# EAGLE design H1FR50 (EAGLE 9.6.2)

## Sheet 1 of 2
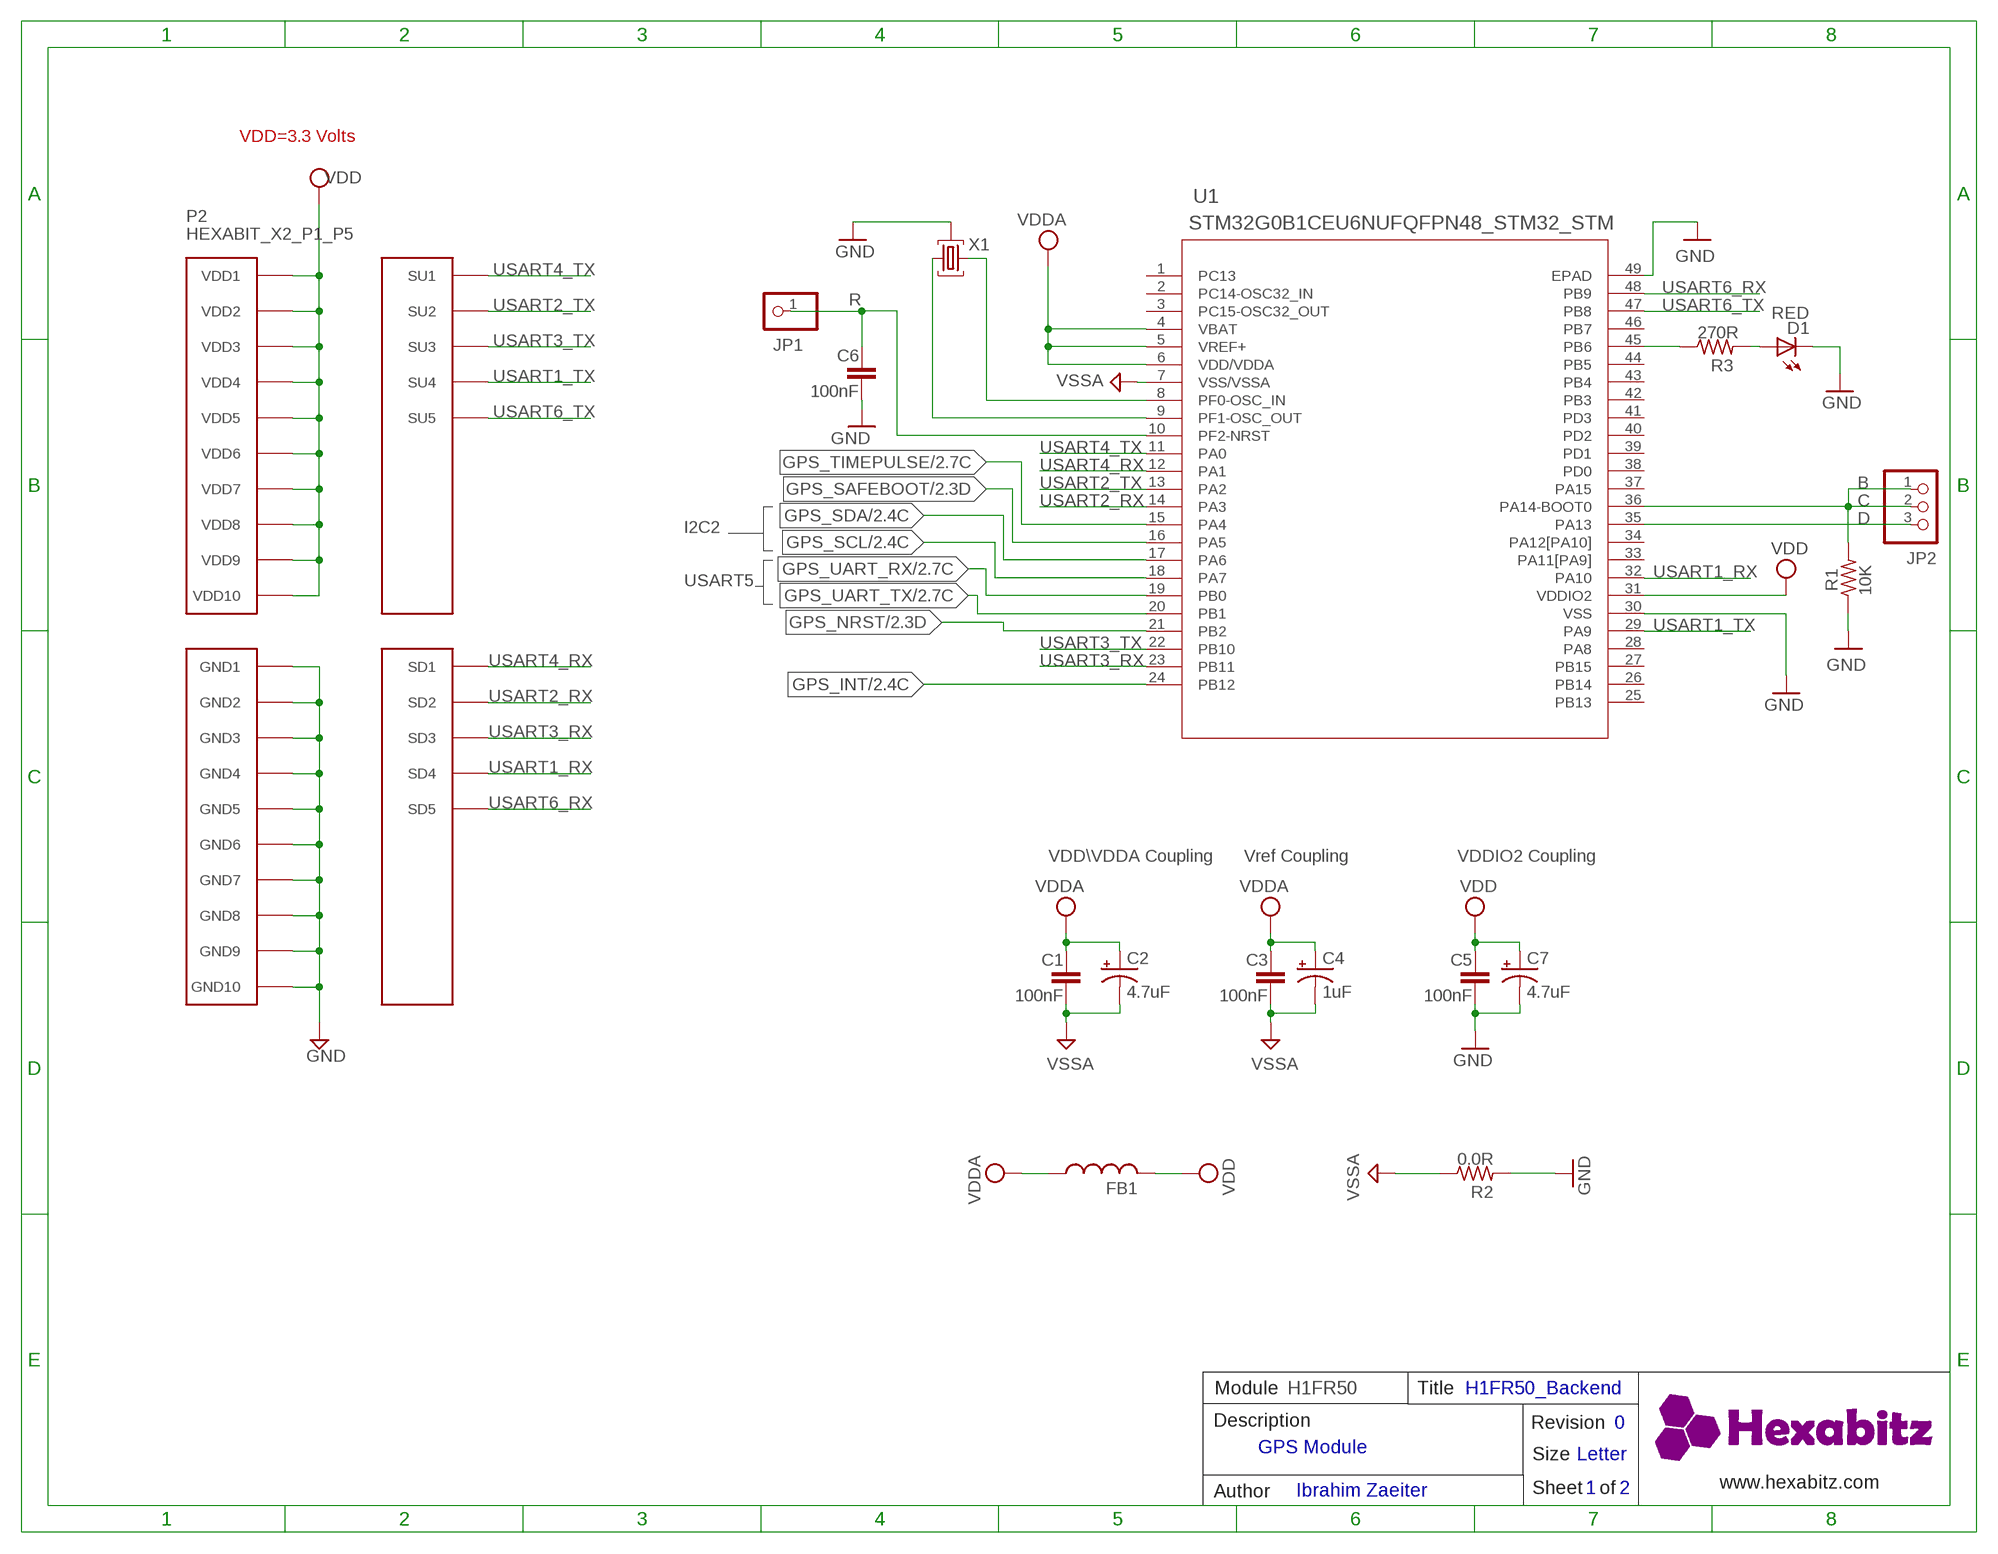
[diagram p0: schematic, sheet 1]

### Parts
C1  100nF  C-0603  [C-0603]
C2  4.7uF  C-0805-POL  [C-0805-POL]
C3  100nF  C-0603  [C-0603]
C4  1uF  C-0805-POL  [C-0805-POL]
C5  100nF  C-0603  [C-0603]
C6  100nF  C-0603  [C-0603]
C7  4.7uF  C-0805-POL  [C-0805-POL]
D1  RED  VLMS1300-GS08  [VLMS1300-GS08]
FB1  FB-0603  [FB-0603]
JP1  R  PINHD-1X1  [1X01]
JP2  PINHD-1X3  [1X03]
P2  HEXABIT_X2_P1_P5  [HEXABIT_17.32_X2_P1_P5]
R1  10K  R-0603  [R-0603]
R2  0.0R  R-0603  [R-0603]
R3  270R  R-0603  [R-0603]
U1  STM32G0B1CEU6NUFQFPN48_STM32_STM  [UFQFPN48_STM32_STM]
X1  XTALL_CSTCE8M00G52  [XTALL_CSTCE8M00G52]

### Nets
C: JP2.1 JP2.2 R1.2 U1.36(PA14-BOOT0)
D: JP2.3 U1.35(PA13)
GND: C5.2 C6.2 C7.2(-) D1.C P2.PAD_PD11(GND1) P2.PAD_PD12(GND2) P2.PAD_PD13(GND3) P2.PAD_PD14(GND4) P2.PAD_PD15(GND5) P2.PAD_PD16(GND6) P2.PAD_PD17(GND7) P2.PAD_PD18(GND8) P2.PAD_PD19(GND9) P2.PAD_PD20(GND10) R1.1 R2.2 U1.30(VSS) U1.49(EPAD) X1.P$2 ; also sheet 2
GPS_INT: U1.24(PB12) ; also sheet 2
GPS_NRST: U1.21(PB2) ; also sheet 2
GPS_SAFEBOOT: U1.16(PA5) ; also sheet 2
GPS_SCL: U1.18(PA7) ; also sheet 2
GPS_SDA: U1.17(PA6) ; also sheet 2
GPS_TIMEPULSE: U1.15(PA4) ; also sheet 2
GPS_UART_RX: U1.19(PB0) ; also sheet 2
GPS_UART_TX: U1.20(PB1) ; also sheet 2
N$1: D1.A R3.2
N$2: U1.8(PF0-OSC_IN) X1.P$1
N$3: U1.9(PF1-OSC_OUT) X1.P$3
N$5: C6.1 JP1.1 U1.10(PF2-NRST)
N$14: R3.1 U1.45(PB6)
USART1_RX: P2.PAD_PD4(SD4) U1.32(PA10)
USART1_TX: P2.PAD_PU4(SU4) U1.29(PA9)
USART2_RX: P2.PAD_PD2(SD2) U1.14(PA3)
USART2_TX: P2.PAD_PU2(SU2) U1.13(PA2)
USART3_RX: P2.PAD_PD3(SD3) U1.23(PB11)
USART3_TX: P2.PAD_PU3(SU3) U1.22(PB10)
USART4_RX: P2.PAD_PD1(SD1) U1.12(PA1)
USART4_TX: P2.PAD_PU1(SU1) U1.11(PA0)
USART6_RX: P2.PAD_PD5(SD5) U1.48(PB9)
USART6_TX: P2.PAD_PU5(SU5) U1.47(PB8)
VDD: C5.1 C7.1(+) FB1.2 P2.PAD_PU11(VDD1) P2.PAD_PU12(VDD2) P2.PAD_PU13(VDD3) P2.PAD_PU14(VDD4) P2.PAD_PU15(VDD5) P2.PAD_PU16(VDD6) P2.PAD_PU17(VDD7) P2.PAD_PU18(VDD8) P2.PAD_PU19(VDD9) P2.PAD_PU20(VDD10) U1.31(VDDIO2) ; also sheet 2
VDDA: C1.1 C2.1(+) C3.1 C4.1(+) FB1.1 U1.4(VBAT) U1.5(VREF+) U1.6(VDD/VDDA)
VSSA: C1.2 C2.2(-) C3.2 C4.2(-) R2.1 U1.7(VSS/VSSA)
Unconnected: U1.1(PC13) U1.2(PC14-OSC32_IN) U1.3(PC15-OSC32_OUT) U1.25(PB13) U1.26(PB14) U1.27(PB15) U1.28(PA8) U1.33(PA11[PA9]) U1.34(PA12[PA10]) U1.37(PA15) U1.38(PD0) U1.39(PD1) U1.40(PD2) U1.41(PD3) U1.42(PB3) U1.43(PB4) U1.44(PB5) U1.46(PB7)

### Notes on the sheet
- VDD=3.3 Volts
- B
- I2C2
- USART5
- VDD\VDDA Coupling | Vref Coupling | VDDIO2 Coupling
- Module | H1FR50 | Title | H1FR50_Backend
- Description | Revision | 0
- GPS Module
- Size | Letter
- www.hexabitz.com
- Author | Ibrahim Zaeiter | Sheet   of | 1 | 2
- C:/Users/Admin/Desktop/logodraft.bmp

## Sheet 2 of 2
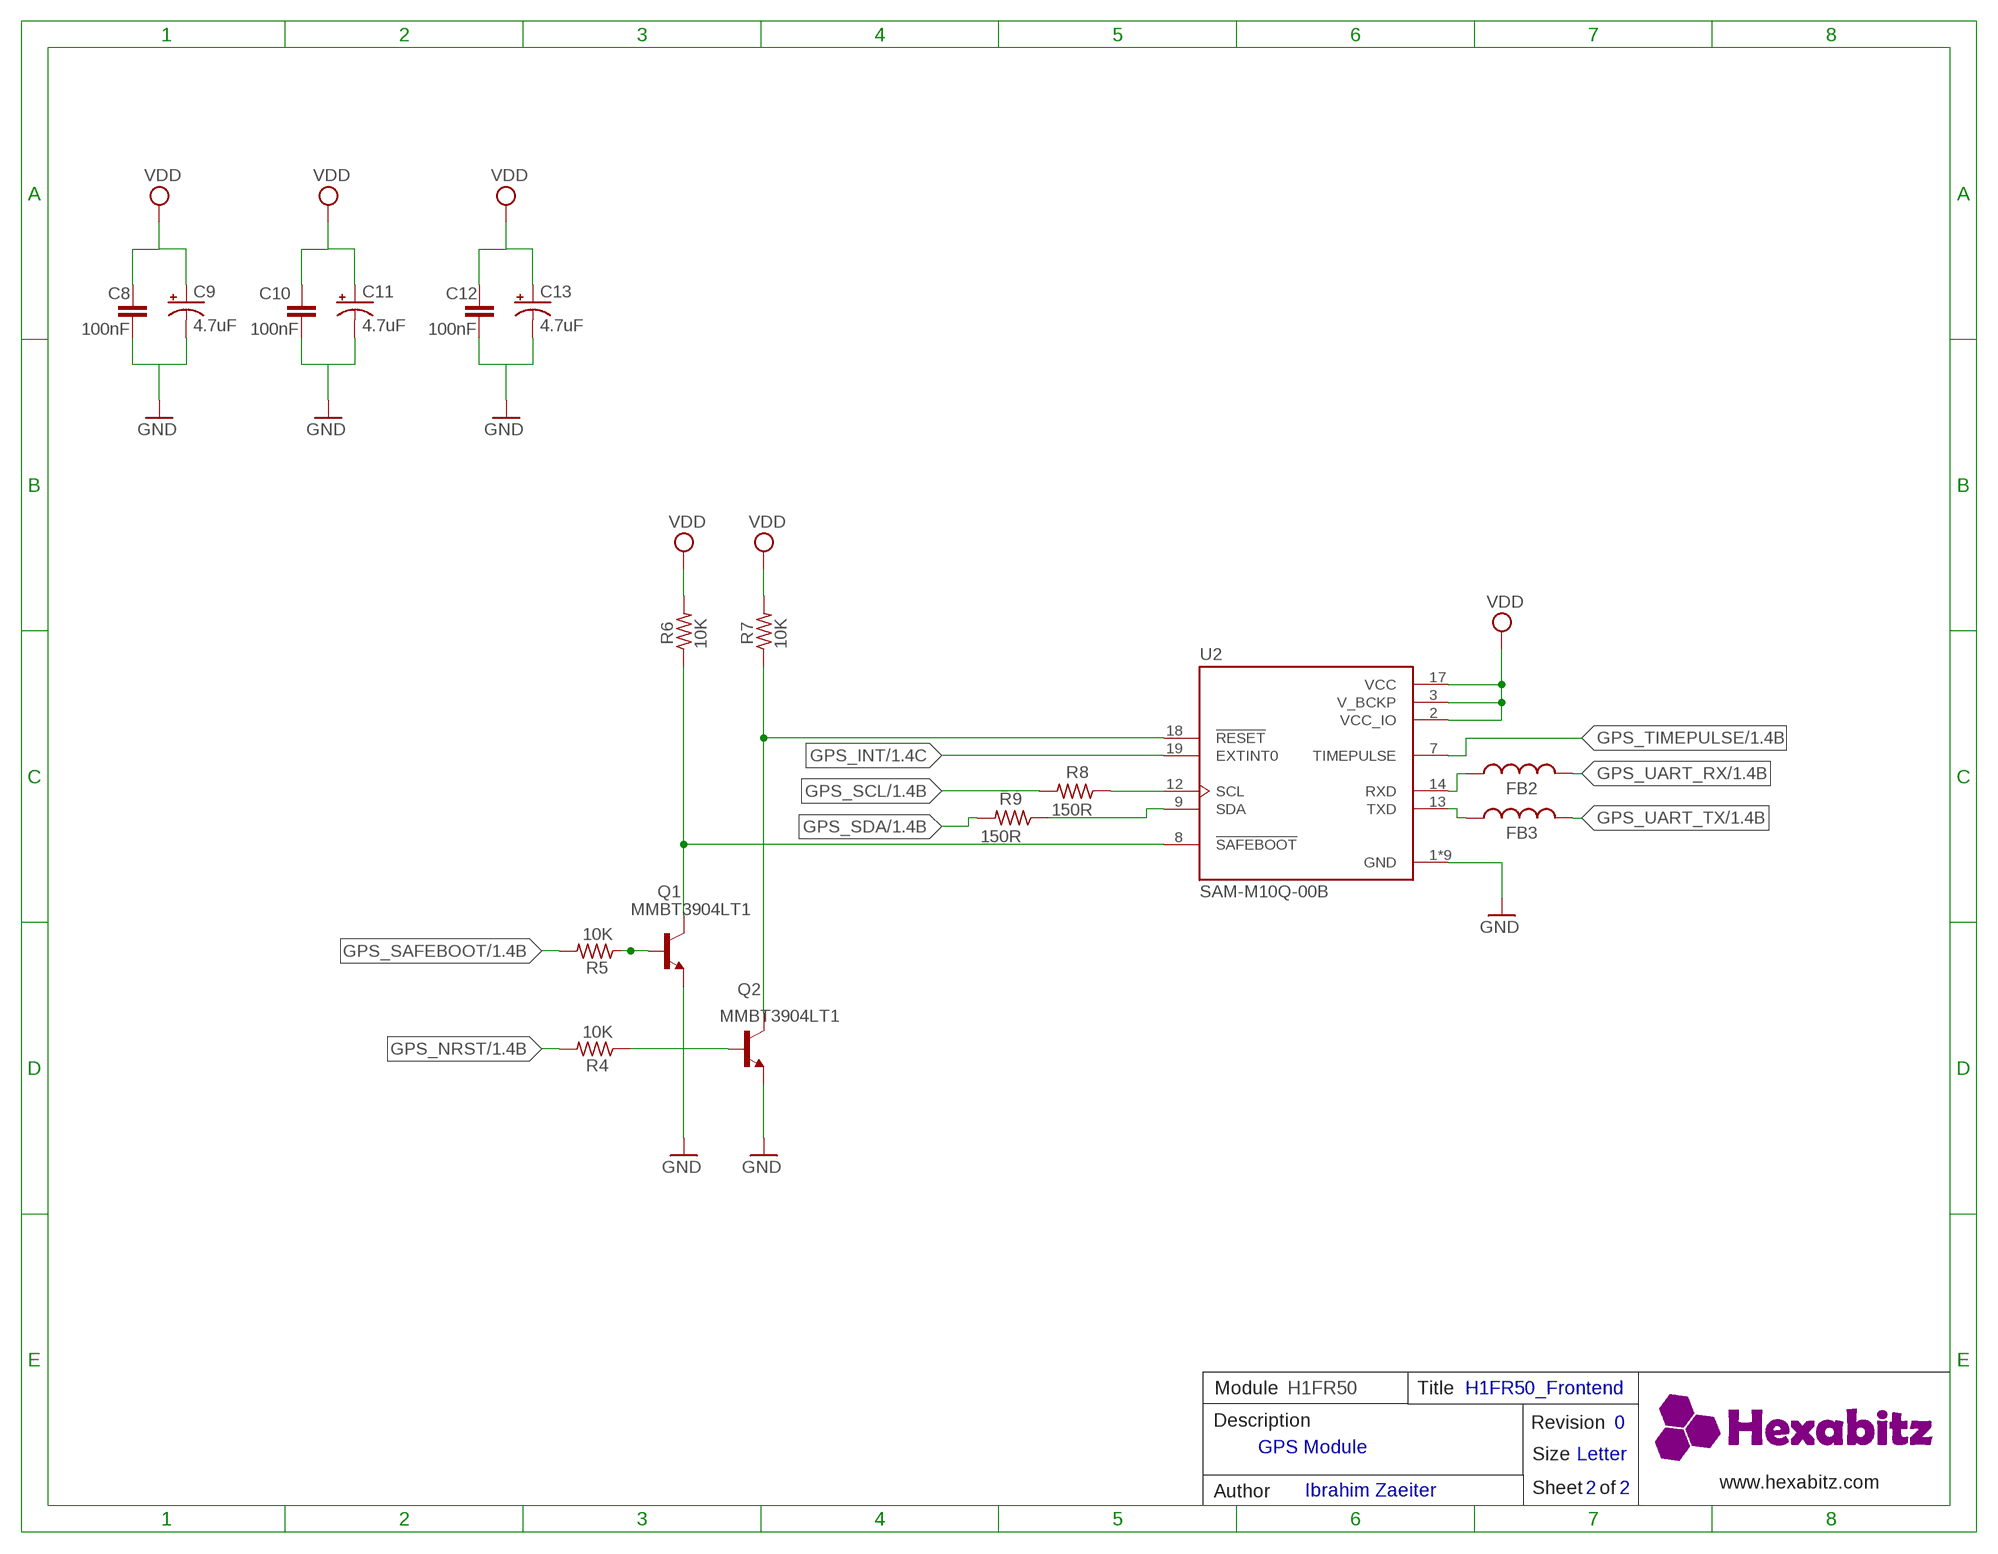
[diagram p1: schematic, sheet 2]

### Parts
C8  100nF  C-0603  [C-0603]
C9  4.7uF  C-0805-POL  [C-0805-POL]
C10  100nF  C-0603  [C-0603]
C11  4.7uF  C-0805-POL  [C-0805-POL]
C12  100nF  C-0603  [C-0603]
C13  4.7uF  C-0805-POL  [C-0805-POL]
FB2  BLM18KG601SN1D  FB-0603  [FB-0603]
FB3  BLM18KG601SN1D  FB-0603  [FB-0603]
Q1  MMBT3904LT1  [MMBT3904LT1]
Q2  MMBT3904LT1  [MMBT3904LT1]
R4  10K  R-0603  [R-0603]
R5  10K  R-0603  [R-0603]
R6  10K  R-0603  [R-0603]
R7  10K  R-0603  [R-0603]
R8  150R  R-0603  [R-0603]
R9  150R  R-0603  [R-0603]
U2  SAM-M8Q-0-10  [MODULE_SAM-M8Q-0-10]

### Nets
GND: C8.2 C9.2(-) C10.2 C11.2(-) C12.2 C13.2(-) Q1.2(E) Q2.2(E) U2.1(GND) U2.4(GND) U2.5(GND) U2.6(GND) U2.10(GND) U2.11(GND) U2.15(GND) U2.16(GND) U2.20(GND) ; also sheet 1
GPS_INT: U2.19(EXTINT0) ; also sheet 1
GPS_NRST: R4.2 ; also sheet 1
GPS_SAFEBOOT: R5.2 ; also sheet 1
GPS_SCL: R8.2 ; also sheet 1
GPS_SDA: R9.2 ; also sheet 1
GPS_TIMEPULSE: U2.7(TIMEPULSE) ; also sheet 1
GPS_UART_RX: FB2.2 ; also sheet 1
GPS_UART_TX: FB3.2 ; also sheet 1
N$4: Q2.3(C) R7.1 U2.18(!RESET)
N$6: Q1.3(C) R6.1 U2.8(!SAFEBOOT)
N$7: Q2.1(B) R4.1
N$8: Q1.1(B) R5.1
N$9: FB2.1 U2.14(RXD)
N$10: FB3.1 U2.13(TXD)
N$11: R8.1 U2.12(SCL)
N$12: R9.1 U2.9(SDA)
VDD: C8.1 C9.1(+) C10.1 C11.1(+) C12.1 C13.1(+) R6.2 R7.2 U2.2(VCC_IO) U2.3(V_BCKP) U2.17(VCC) ; also sheet 1

### Notes on the sheet
- Module | H1FR50 | Title | H1FR50_Frontend
- Description | Revision | 0
- GPS Module
- Size | Letter
- www.hexabitz.com
- Author | Ibrahim Zaeiter | Sheet   of | 2 | 2
- C:/Users/Admin/Desktop/logodraft.bmp

## Library data of the parts
C1 C3 C5 C6 C8 C10 C12 = HEXABITZ_RCLS:C-0603: CAP CER 10% X7R 0603
C2 C4 C7 C9 C11 C13 = HEXABITZ_RCLS:C-0805-POL: Cap Tant Solid SMD 2012
D1 = HEXABITZ_USER_INTERFACE_PARTS:VLMS1300-GS08: Red 0603 130° Clear 54 mcd 2 V Surface Mount ChipLED ; Octopart Url : http://octopart.com/vlms1300-gs08-vishay-21709201; MFN: Vishay; MPN: VLMS1300-GS08; OCTOPART_URL: https://octopart.com/vlms1300-gs08-vishay-21709201?r=sp&s=0nXJNjGsSbWwqfqWlZv0EA
FB1-FB3 = HEXABITZ_RCLS:FB-0603: Ferrite Beads Multi-Layer 0603
JP1 = HEXABITZ_USER_INTERFACE_PARTS:PINHD-1X1: PIN HEADER; MFN: TE Connectivity; MPN: 87227-1; OCTOPART_URL: https://octopart.com/87227-1-te+connectivity-39512052?r=sp
JP2 = pinhead:PINHD-1X3: PIN HEADER
P2 = hexabitz_connectors:HEXABIT_X2_P1_P5
Q1 Q2 = HEXABITZ_RCLS:MMBT3904LT1: TRANS NPN 40V 0.2A SOT23; MOUNTING_STYLE: Surface Mount; NUM_OF_PINS: 3; PACKAGE: SOT-23-3; PACKAGING: Reel; PRODUCT_CATEGORY: Transistors Bipolar-BJT; SERIES: MMBT3904L
R1-R7 = HEXABITZ_RCLS:R-0603: Thick Film Resistors - SMD 0603
R8 R9 = HEXABITZ_RCLS:R-0603: Thick Film Resistors - SMD 0603; MPN: CRCW0603150RFKEA
U1 = HEXABITZ_ICs:STM32G0B1CEU6N; COPYRIGHT: Copyright (C) 2022 Ultra Librarian. All rights reserved.; MFN: STMicroelectronics; MPN: STM32G0B1CEU6N; OCTOPART_URL: https://app.ultralibrarian.com/details/c038d58b-752a-11eb-9033-0a34d6323d74/STMicroelectronics/STM32G0B1CEU6N?uid=116364672
U2 = SAM-M8Q-0-10:SAM-M8Q-0-10: Concurrent GNSS LGA antenna module, TCXO, SAW, LNA Check availability <https://pricing.snapeda.com/parts/SAM-M8Q-0-10/U-Blox/view-part?ref=eda>; AVAILABILITY: In Stock; DESCRIPTION: series RF Receiver Galileo, GLONASS, GPS 1.575GHz, 1.602GHz -165dBm 400kbps On-Board, Patch Module; MF: U-Blox; MP: SAM-M10Q-00B; PACKAGE: SMD-20 u-blox; PRICE: None; PURCHASE-URL: https://pricing.snapeda.com/search/part/SAM-M8Q-0-10/?ref=eda
X1 = HEXABITZ_RCLS:XTALL_CSTCE8M00G52: MURATA CSTCE8M00G52-R0 RESONATOR, SMD, 8MHZ ; Octopart Url : https://octopart.com/cstce8m00g52-r0-murata-7145559; MFN: Murata; MPN: CSTCE8M00G52Z-R0; OCTOPART_URL: https://octopart.com/cstce8m00g52z-r0-murata-17755941?r=sp&s=JDnNJnrHQhyS8Zk4ofFWXw

## Board
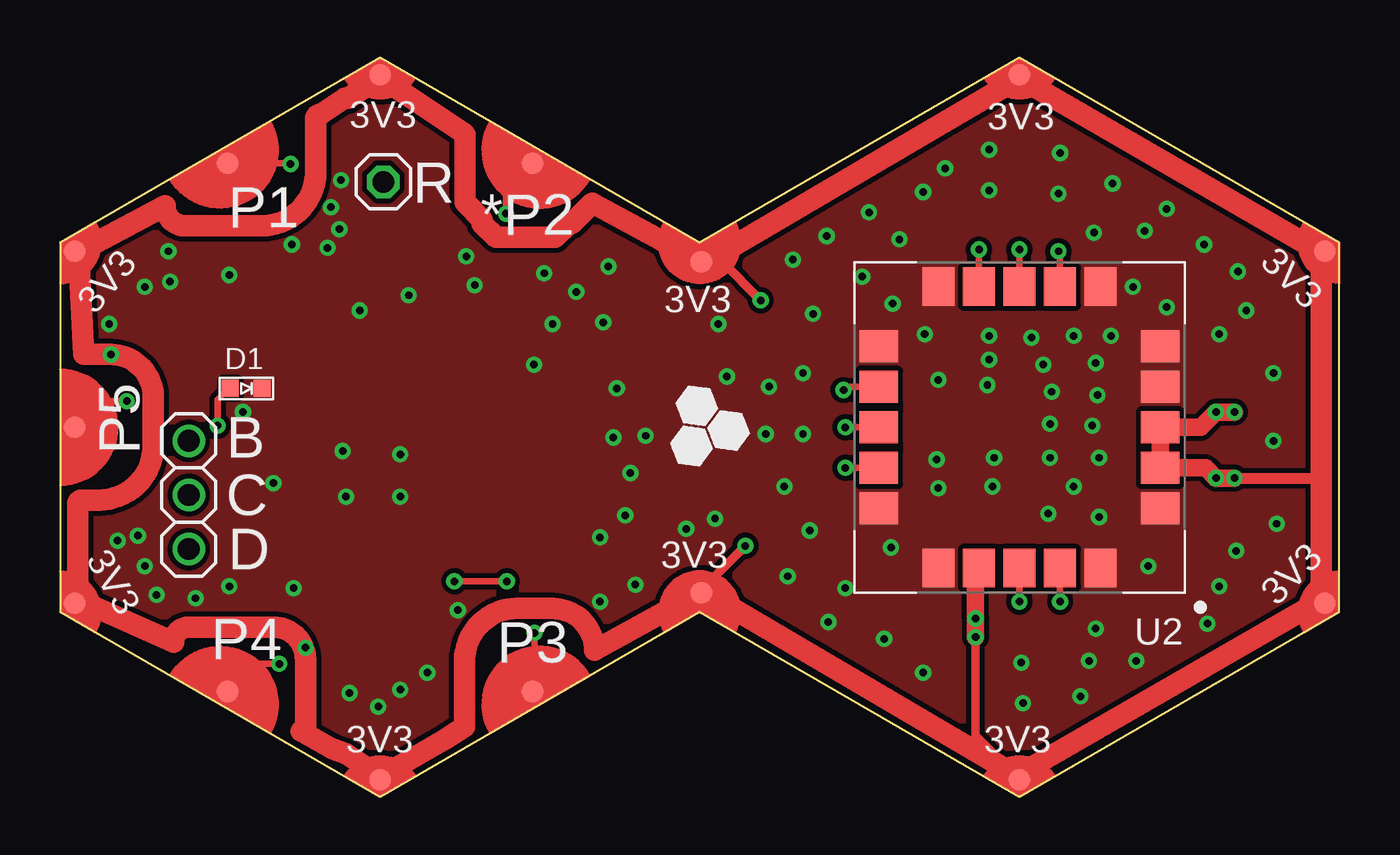
[diagram p2: board, top side]
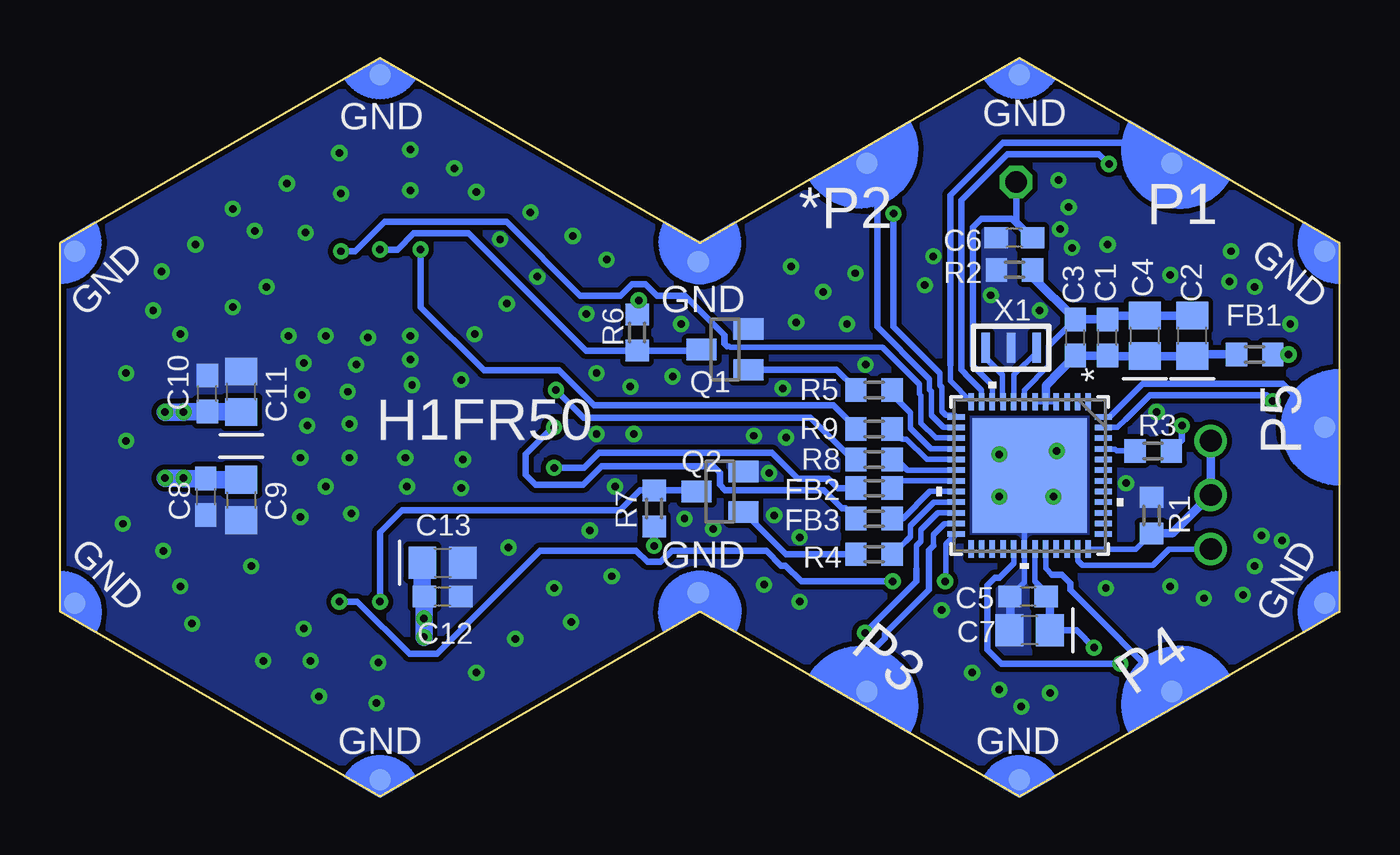
[diagram p3: board, bottom side, seen from below]

Size 60 x 34.64 mm. Coordinates in mm from the lower left corner, seen from the top.
Copper layers (1*16): Top 0.035mm / dielectric 1.5mm / Bottom 0.035mm
Design rules "default *": minimum track width 6mil, minimum drill 0.35mm, track to track 9mil, track to pad 9mil, pad to pad 9mil, via to via 9mil, smd to smd 0mil, copper to edge 10mil, drill to drill 6mil, minimum pad ring 10mil, minimum via ring 8mil, stop-mask expansion 4mil, vias tented up to drill 24mil, thermal gap 10mil

### Footprints (pad centres in the part's own frame; a part is rotated, then mirrored left to right if it is on the bottom)
C-0603 = smd 1.1 x 1: 1 -0.85,0; 2 0.85,0
C-0805-POL = smd 1.3 x 1.5: 1 -0.95,0; 2 0.95,0
VLMS1300-GS08 = smd 0.8 x 0.8: A 0,0.75; C 0,-0.75
FB-0603 = smd 1 x 1.1: 1 -0.85,0; 2 0.85,0
1X01 = drill 1.016 octagon: 1 0,0
1X03 = drill 1.016: 1 -2.54,0; 2 0,0; 3 2.54,0
HEXABIT_17.32_X2_P1_P5 = smd 1 x 1 bottom: PAD_PD1 12.39,22.39; PAD_PD2 12.39,8.09; PAD_PD3 -12.39,8.09; PAD_PD4 -12.39,22.39; PAD_PD5 0,29.55; PAD_PD12 16.52,15.24; PAD_PD13 7.752,0.168; PAD_PD14 16.52,-14.76; PAD_PD15 8.26,-29.07; PAD_PD16 -8.26,-29.07; PAD_PD17 -16.52,-14.76; PAD_PD18 -7.752,0.168; PAD_PD19 -16.52,15.24 | smd 1 x 1 rotated 60 bottom: PAD_PD11 8.26,29.547 | smd 1 x 1 rotated 120 bottom: PAD_PD20 -8.26,29.547 | smd 1 x 1: PAD_PU1 12.39,22.39; PAD_PU2 12.39,8.09; PAD_PU3 -12.39,8.09; PAD_PU4 -12.39,22.39; PAD_PU5 0,29.55; PAD_PU12 16.52,15.24; PAD_PU13 7.752,0.168; PAD_PU14 16.52,-14.76; PAD_PU15 8.26,-29.07; PAD_PU16 -8.26,-29.07; PAD_PU17 -16.52,-14.76; PAD_PU18 -7.752,0.168; PAD_PU19 -16.52,15.24 | smd 1 x 1 rotated 60: PAD_PU11 8.26,29.547 | smd 1 x 1 rotated 120: PAD_PU20 -8.26,29.547
MMBT3904LT1 = smd 1 x 1.4: 1 -0.95,-1.1; 2 0.95,-1.1; 3 0,1.1
R-0603 = smd 1 x 1.1: 1 -0.85,0; 2 0.85,0
UFQFPN48_STM32_STM = smd 0.813 x 0.254: 1 -3.454,2.751; 2 -3.454,2.251; 3 -3.454,1.75; 4 -3.454,1.25; 5 -3.454,0.75; 6 -3.454,0.25; 7 -3.454,-0.25; 8 -3.454,-0.75; 9 -3.454,-1.25; 10 -3.454,-1.75; 11 -3.454,-2.251; 12 -3.454,-2.751; 25 3.454,-2.751; 26 3.454,-2.251; 27 3.454,-1.75; 28 3.454,-1.25; 29 3.454,-0.75; 30 3.454,-0.25; 31 3.454,0.25; 32 3.454,0.75; 33 3.454,1.25; 34 3.454,1.75; 35 3.454,2.251; 36 3.454,2.751 | smd 0.254 x 0.813: 13 -2.751,-3.454; 14 -2.251,-3.454; 15 -1.75,-3.454; 16 -1.25,-3.454; 17 -0.75,-3.454; 18 -0.25,-3.454; 19 0.25,-3.454; 20 0.75,-3.454; 21 1.25,-3.454; 22 1.75,-3.454; 23 2.251,-3.454; 24 2.751,-3.454; 37 2.751,3.454; 38 2.251,3.454; 39 1.75,3.454; 40 1.25,3.454; 41 0.75,3.454; 42 0.25,3.454; 43 -0.25,3.454; 44 -0.75,3.454; 45 -1.25,3.454; 46 -1.75,3.454; 47 -2.251,3.454; 48 -2.751,3.454 | smd 5.385 x 5.385: 49 0,0
MODULE_SAM-M8Q-0-10 = smd 1.8 x 1.5: 1 -6.6,3.8; 2 -6.6,1.9; 3 -6.6,0; 4 -6.6,-1.9; 5 -6.6,-3.8; 11 6.6,-3.8; 12 6.6,-1.9; 13 6.6,0; 14 6.6,1.9; 15 6.6,3.8 | smd 1.5 x 1.8: 6 -3.8,-6.6; 7 -1.9,-6.6; 8 0,-6.6; 9 1.9,-6.6; 10 3.8,-6.6; 16 3.8,6.6; 17 1.9,6.6; 18 0,6.6; 19 -1.9,6.6; 20 -3.8,6.6
XTALL_CSTCE8M00G52 = smd 1.4 x 0.4: P$1 0,1.2; P$2 0,0; P$3 0,-1.2

### Placement (x,y rotation side)
C1  10.87,21.53 90 bottom
C2  6.9,21.61 90 bottom
C3  12.38,21.53 90 bottom
C4  9.13,21.61 90 bottom
C5  14.6,9.38 180 bottom
C6  15.24,26.21 180 bottom
C7  14.52,7.8 180 bottom
C8  53.18,14.07 270 bottom
C9  51.51,13.91 270 bottom
C10  53.1,18.91 90 bottom
C11  51.51,18.99 90 bottom
C12  42.07,9.38 0 bottom
C13  42.07,10.97 0 bottom
D1  8.73,19.15 90 top
FB1  3.97,20.73 0 bottom
FB2  21.83,14.46 0 bottom
FB3  21.83,13.03 0 bottom
JP1  15.16,28.83 0 top
JP2  6.03,14.15 270 top
P2  30.24,17.32 90 top
Q1  28.81,20.97 90 bottom
Q2  29.05,14.3 90 bottom
R1  8.81,13.19 270 bottom
R2  15.24,24.7 180 bottom
R3  8.73,16.21 0 bottom
R4  21.83,11.37 0 bottom
R5  21.83,19.07 0 bottom
R6  32.94,21.77 90 bottom
R7  32.14,13.51 270 bottom
R8  21.83,15.81 0 bottom
R9  21.83,17.24 0 bottom
U1  14.53,15.06 270 bottom
U2  45,17.32 180 top
X1  15.4,21.05 270 bottom

### Tracks (layer width: path | path; a pad name or v marks a point on that pad's centre or on a via)
C
  Bottom 0.254: U1.36 9.55,11.6 R1.2
  Bottom 0.406: JP2.1 JP2.2 7.83,12.34 R1.2
D
  Bottom 0.254: JP2.3 7.99,11.6 8.75,10.84 12.05,10.84 12.26,11.05 12.26,11.59 U1.35
GND  (via drill 0.35)
  Bottom 0.254: C5.2 15.42,9.41 14.78,10.06 U1.30 14.78,12.89 v15.95,14.07
  Bottom 0.406: C7.2 15.42,7.84 15.42,9.41
  other vias: 13.17,28.91 13.09,26.61 35.95,26.29 19.45,23.99 15.95,16.05 13.25,16.21 13.41,14.07 10,14.7 49.29,21.61 47.54,21.61 45.56,21.53 43.57,21.61 40.56,21.69 39.05,23.11 50.32,23.91 51.91,22.96 48.5,26.45 50.88,26.53 53.66,25.89 46.83,28.27 43.57,28.43 40.48,28.35 49.37,28.75 46.91,30.18 43.57,30.34 37.94,27.4 34.37,25.18 48.66,18.83 46.51,18.99 43.5,19.3 41.19,19.54 48.73,15.89 48.73,13.11 46.35,13.27 46.43,15.89 43.81,15.89 41.11,15.81 38.97,11.68 36.83,9.78 34.13,10.34 38.65,7.4 45.08,6.29 48.26,6.37 53.81,8.11 55.16,11.53 51.04,10.81 56.91,16.69 56.91,19.86 55.64,22.8 22.7,24.54 25.72,24.86 23.1,22.16 25.48,22.24 18.65,8.75 17.22,5.81 14.92,4.22 13.57,4.86 6.35,9.3 3.65,12.24 4.52,9.46 3.97,23.91 5.08,25.57 10.87,25.89 12.7,27.64 19.05,25.34 2.3,22.16 26.99,9.94 40.48,5.81 57.07,12.8 16.35,23.51 14.05,22.8 26.11,19.15 31.27,19.7 33.26,19.23 34.84,19.86 26.51,13.19 25.32,12.16 30.72,13.03 29.37,12.56 35.32,22.64 39.37,26.13 37.62,24.38 30.88,22.16 22.22,20.26 35.16,12.48 45.16,4.38 47.86,4.7 48.58,7.87 50.48,6.37 54.37,9.86 54.37,21.69 55.24,24.62 48.42,17.4 46.43,17.48 48.58,20.34 46.11,20.26 43.57,20.5 41.19,14.46 43.73,14.54 47.54,14.54 24.21,23.67 7.94,24.46 5.16,24.15 2.7,12 3.97,10.81 10.95,9.78 7.94,9.86 36.03,8.19 51.91,27.56 41.51,29.46 25.32,9.14 15.95,5.02 8.57,18.03 12.54,25.73 25.95,16.84 27.46,16.92 33.1,17 34.84,17 26.75,15.18 33.97,14.54
  pour Top (rank 2, no thermals): 0.08,25.97 14.92,34.54 29.92,26.05 45,34.7 59.93,25.89 59.93,8.75 45.08,0.02 30.08,8.59 15.08,0.02 0,8.59
  pour Bottom (no thermals): -0.08,25.97 14.92,34.62 30,26.05 44.84,34.62 59.93,26.05 60.08,8.75 45,0.02 30,8.67 15.16,0.1 0.08,8.67
GPS_INT  (via drill 0.35)
  Top 0.305: U2.19 v46.9,9.15 v46.91,9.14 | v20.95,10.1 v18.49,10.1
  Bottom 0.254: 18.46,10.13 18.46,11.83 U1.24
  Bottom 0.305: v46.91,9.14 46.08,9.14 43.62,6.69 42.32,6.69 37.48,11.53 32.98,11.53 32.46,11 31.83,11 31.31,11.53 26.88,11.53 26.18,10.83 25.98,10.83 25.24,10.1 v20.95,10.1 | v18.49,10.1 18.46,10.13
GPS_NRST
  Bottom 0.254: R4.2 20.93,11.37 20.32,11.97 20.12,12.18 20.12,12.71 19.02,13.81 U1.21
GPS_SAFEBOOT
  Bottom 0.254: R5.2 20.98,18.86 20.11,17.99 20.11,17.27 19.15,16.31 U1.16
GPS_SCL
  Bottom 0.254: R8.2 20.77,15.81 20.27,15.31 U1.18
GPS_SDA
  Bottom 0.254: R9.2 20.5,16.76 20.3,16.76 19.35,15.81 U1.17
GPS_TIMEPULSE  (via drill 0.35)
  Top 0.305: U2.7 46.9,25.5 v46.83,25.57
  Bottom 0.254: U1.15 18,16.83 18.93,16.83 19.62,17.51 19.62,18.8 19.7,18.89 19.7,19.34 21.42,21.07 28.56,21.07 28.62,21.13 28.73,21.13
  Bottom 0.305: v46.83,25.57 46.16,25.57 44.78,26.95 39.07,26.95 35.62,23.5 33.71,23.5 33.17,24.03 32.54,24.03 32.01,23.5 30.7,23.5 28.83,21.63 28.83,21.23 28.73,21.13
GPS_UART_RX
  Bottom 0.254: U1.19 20.63,14.81 FB2.2
GPS_UART_TX
  Bottom 0.254: U1.20 19.2,14.31 20.48,13.03 FB3.2
N$1  (via drill 0.35)
  Top 0.305: v7.38,17.4 7.38,18.63 7.9,19.15 D1.A
  Bottom 0.305: R3.2 7.38,16.71 v7.38,17.4
N$2
  Bottom 0.254: U1.8 15.26,18.53 15.26,19.78 14.2,20.84 X1.P$1
N$3
  Bottom 0.254: U1.9 15.79,18.53 15.79,19.77 16.6,20.57 X1.P$3
N$4  (via drill 0.35)
  Top 0.305: U2.18 v45,9.14
  Bottom 0.305: v45,9.14 45,12.4 43.97,13.43 33.73,13.43 32.8,14.36 R7.1 30.21,14.36 Q2.3
N$5
  Bottom 0.254: U1.10 16.28,19.29 17.21,20.23 17.21,22.03 17.19,22.06
  Bottom 0.305: JP1.1 15.16,26.98 C6.1 14.5,26.21 15.38,27.09 16.8,27.09 17.19,26.7 17.19,22.06
N$6  (via drill 0.35)
  Top 0.305: U2.8 v45,25.65
  Bottom 0.305: Q1.3 29.97,20.91 R6.1 35.34,20.91 40.84,26.41 43.41,26.41 44.17,25.65 v45,25.65
N$7
  Bottom 0.305: R4.1 25.96,11.37 Q2.1
N$8
  Bottom 0.305: Q1.1 23.58,20.02 22.68,19.12 R5.1
N$9  (via drill 0.35)
  Top 0.305: v36.83,15.41 v36.83,15.42 U2.14
  Bottom 0.305: v36.83,15.41 35.44,15.41 34.72,16.13 26.61,16.13 25.39,14.91 23.95,14.91 23.51,14.46 FB2.1
N$10  (via drill 0.35)
  Top 0.305: U2.13 v36.83,17.32
  Bottom 0.305: FB3.1 23.17,13.53 23.33,13.53 24.17,14.37 28.81,14.37 29.05,14.61 29.05,15.18 29.37,15.49 34.61,15.49 35.48,14.62 37.7,14.62 38.18,15.1 38.18,16.05 36.91,17.32 v36.83,17.32
N$11  (via drill 0.35)
  Top 0.305: U2.12 36.9,19.22 v36.75,19.07
  Bottom 0.305: v36.75,19.07 35.46,17.77 24.8,17.77 22.84,15.81 R8.1
N$12  (via drill 0.35)
  Top 0.305: U2.9 v43.1,25.65
  Bottom 0.305: R9.1 22.68,17.29 23.73,18.35 34.95,18.35 36.59,19.98 40.13,19.98 43.1,22.96 v43.1,25.65
N$14
  Bottom 0.254: U1.45 11.05,16.29 10.52,16.29 10.44,16.21 R3.1
USART1_RX
  Bottom 0.254: 13.49,10.41 13.78,10.7 U1.32
  Bottom 0.305: P2.PAD_PD4 12.62,9.7 12.62,10.02 13.02,10.41 13.49,10.41
USART1_TX  (via drill 0.35)
  Top 0.305: P2.PAD_PU4 9.14,6.22 v10.28,6.22
  Bottom 0.254: 15.95,10.26 15.28,10.94 U1.29
  Bottom 0.305: 15.95,10.26 16.16,10.26 16.5,9.92 16.5,6.89 15.84,6.22 v10.28,6.22
USART2_RX
  Bottom 0.254: U1.14 18.57,17.31 19.13,17.88 19.13,19 19.22,19.09 19.22,19.58 19.43,19.79
  Bottom 0.305: P2.PAD_PD2 21.67,29.23 21.67,22.03 19.43,19.79
USART2_TX  (via drill 0.35)
  Top 0.305: P2.PAD_PU2 20.91,28.47 v20.91,27.33
  Bottom 0.254: U1.13 18.05,17.88 18.45,17.88 18.65,18.08 18.65,19.2 18.74,19.29 18.74,19.85 19.61,20.73
  Bottom 0.305: v20.91,27.33 20.91,22.02 19.61,20.73
USART3_RX
  Bottom 0.254: U1.23 18,12.79 18.53,12.79 19.05,12.28 19.05,11.76
  Bottom 0.305: P2.PAD_PD3 22.15,6.6 21.32,7.43 21.32,7.63 19.25,9.7 19.25,11.56 19.05,11.76
USART3_TX  (via drill 0.35)
  Top 0.305: v22.25,7.68 22.25,5.03 P2.PAD_PU3
  Bottom 0.254: 19.84,10.65 19.84,11.77 19.64,11.98 19.64,12.51 18.84,13.31 U1.22
  Bottom 0.305: 19.84,10.65 19.84,10.09 v22.25,7.68
USART4_RX
  Bottom 0.254: U1.12 18.25,19.49 18.25,20.26
  Bottom 0.305: P2.PAD_PD1 8.09,29.71 9.04,30.66 15.79,30.66 18.25,28.19 18.25,20.26
USART4_TX  (via drill 0.35)
  Top 0.305: P2.PAD_PU1 10.76,29.71 v10.81,29.66
  Bottom 0.254: U1.11 16.79,18.53 16.79,19.07 17.56,19.83 17.56,19.86
  Bottom 0.305: v10.81,29.66 11.27,30.13 15.56,30.13 17.72,27.97 17.72,20.02 17.56,19.86
USART6_RX
  Bottom 0.254: U1.48 10.76,17.81 9.21,19.36
  Bottom 0.305: P2.PAD_PD5 0.69,17.4 2.65,19.36 9.21,19.36
USART6_TX  (via drill 0.35)
  Top 0.305: P2.PAD_PU5 1.92,18.55 v3.13,18.55
  Bottom 0.254: 10,17.72 10.41,17.31 U1.47
  Bottom 0.305: v3.13,18.55 3.41,18.83 8.89,18.83 10,17.72
VDD  (via drill 0.35)
  Top 0.305: v11.51,6.98 11.51,6.45
  Top 0.406: P2.PAD_PU18 30.07,9.69 v32.14,11.76 | v32.86,23.27 31.06,25.07 30.48,25.07 | v42.94,7.48 42.94,2.86 P2.PAD_PU17
  Top 0.508: 55.16,15.02 v55.08,14.94 59.15,14.94
  Top 0.813: v55.08,14.94 v54.21,14.94 53.73,15.42 U2.2 U2.3 53.5,17.32 v54.21,18.03 v55.08,18.03 | U2.17 42.94,10.56 v42.94,8.35 v42.94,7.48
  Top 1.016: 30.48,25.07 P2.PAD_PU13 | 30.59,25.39 30.53,25.28 30.31,25.22 30.2,25.11 30.11,25.11 P2.PAD_PU13 | 15,0.93 P2.PAD_PU19 15,0.94 18.05,2.7 18.97,3.27 18.97,6.37 arc-90 21.43,8.83 23.1,8.83 arc-90 25.07,6.86 29.97,9.57 P2.PAD_PU18 30.29,9.57 44.69,1.11 P2.PAD_PU17 45.59,1.39 59.01,9.14 59.23,9.14 P2.PAD_PU16 59.15,9.22 59.15,14.94 59.15,25.42 P2.PAD_PU15 59.03,25.58 45.38,33.46 P2.PAD_PU14 44.66,33.5 30.31,25.07 P2.PAD_PU13 | 15,0.93 | 15,0.93 13.41,2 12.75,2.24 11.31,3.07 arc90 11.51,3.26 11.51,6.45 arc90 10,7.95 6.03,7.95 arc90 5.32,7.25 1.23,9.06 P2.PAD_PU20 | 0.81,9.13 0.81,13.69 arc-90 1.03,13.91 1.82,13.91 arc90 4.36,16.45 4.36,18.75 arc90 v2.38,20.73 1.11,20.73 0.86,25.41 P2.PAD_PU11 0.92,25.58 4.92,27.72 arc90 5.87,26.77 9.44,26.77 arc90 11.98,29.31 11.98,31.77 arc-90 12.22,32 13.35,32.75 13.51,32.75 14.69,33.53 P2.PAD_PU12 15,33.73 18.89,31.13 18.98,31.04 18.98,27.86 19.79,27.05 19.79,26.87 20.45,26.22 23.22,26.22 23.8,26.8 23.86,26.86 | 23.86,26.86 | 23.86,26.86 23.88,26.88 24.01,26.88 24.96,27.82 28.23,26.07 29.41,25.39 29.46,25.28 29.69,25.22 29.78,25.13 30.01,25.13 P2.PAD_PU13
  Bottom 0.254: C5.1 13.75,9.56 14.29,10.1 14.29,11.6 U1.31
  Bottom 0.305: C7.1 12.32,7.79 v11.51,6.98 | FB1.2 v2.38,20.73
  Bottom 0.406: C7.1 13.57,9.2 C5.1 | v32.14,11.76 R7.2 | R6.2 32.86,22.69 v32.86,23.27
  Bottom 0.813: C9.1 53.12,14.86 C8.1 54.19,14.92 v54.21,14.94 v55.08,14.94 | C11.1 53.08,18.04 C10.1 54.19,18.06 v54.21,18.03 v55.08,18.03 | C13.1 43.02,9.48 C12.1 42.94,9.36 v42.94,7.48
VDDA
  Bottom 0.254: U1.6 U1.5 U1.4
  Bottom 0.406: FB1.1 6.83,20.73 C2.1 C4.1 10.85,20.66 C1.1 C3.1 13.08,19.97 13.78,19.28 U1.5
VSSA
  Bottom 0.254: C3.2 13.64,21.12 13.64,20.2 14.78,19.07 U1.7
  Bottom 0.406: C2.2 C4.2 10.69,22.56 C1.2 C3.2 14.39,24.38 R2.1

### Text on the board
tPlace: 3V3 | 3V3 | R | *P2 | P1 | 3V3 | 3V3 | 3V3 | P5 | B | C | 3V3 | D | 3V3 | 3V3 | P4 | P3 | 3V3 | 3V3
bPlace: P5 | H1FR50 | P3 | P4
bNames: GND | GND | *P2 | P1 | GND | GND | GND | GND | GND | GND | GND | GND